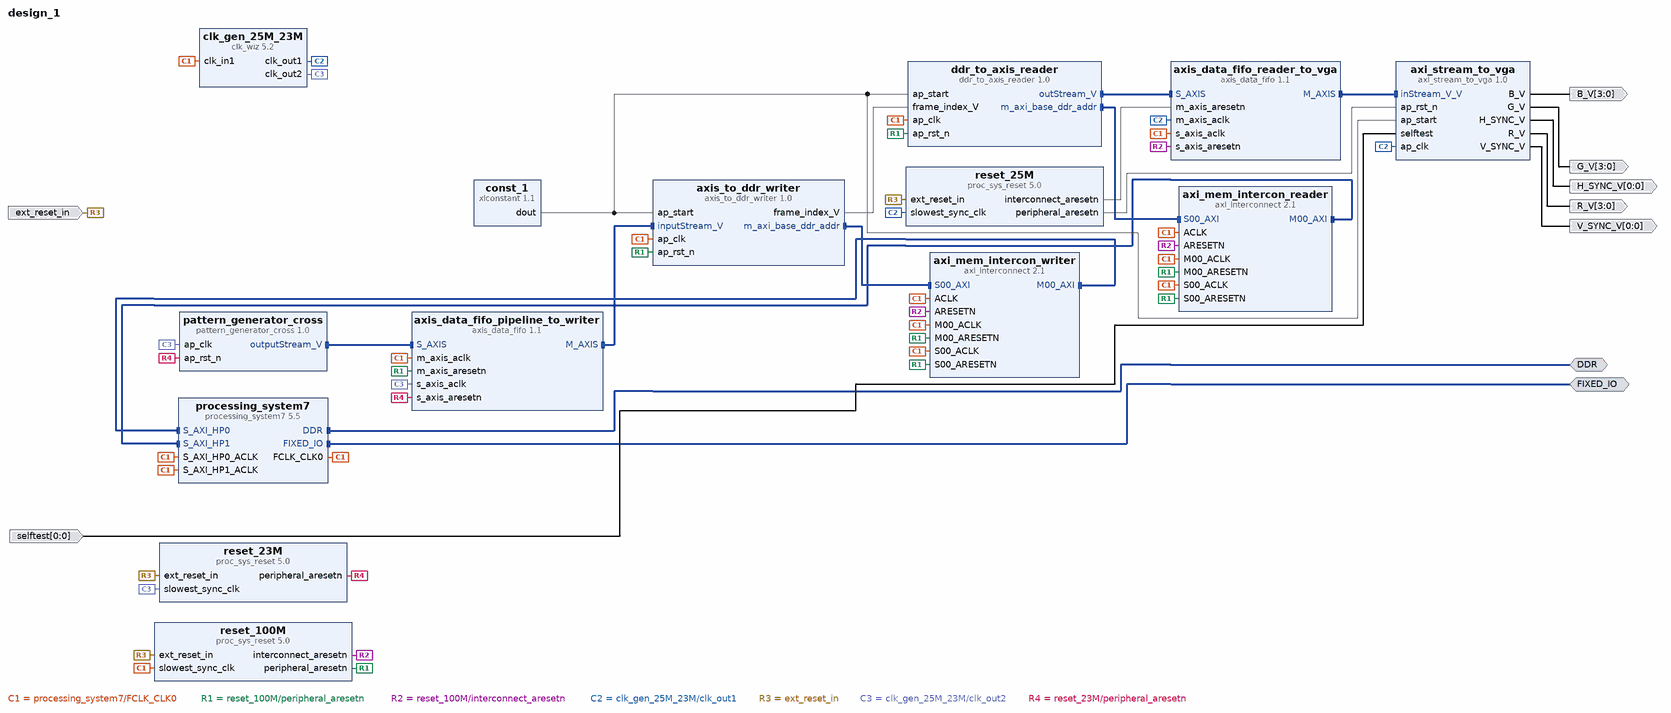
[diagram p0: block diagram of the top level]
# Vivado block design design_1, Vivado 2015.4
create_bd_design design_1

create_bd_intf_port -mode Master -vlnv xilinx.com:interface:ddrx_rtl:1.0 DDR
create_bd_intf_port -mode Master -vlnv xilinx.com:display_processing_system7:fixedio_rtl:1.0 FIXED_IO
create_bd_port -dir I -type rst ext_reset_in
create_bd_port -dir O -from 3 -to 0 -type data R_V
create_bd_port -dir O -from 3 -to 0 -type data G_V
create_bd_port -dir O -from 3 -to 0 -type data B_V
create_bd_port -dir O -from 0 -to 0 -type data V_SYNC_V
create_bd_port -dir O -from 0 -to 0 -type data H_SYNC_V
create_bd_port -dir I -from 0 -to 0 -type data selftest
set_property -dict [list \
  CONFIG.LAYERED_METADATA {xilinx.com:interface:datatypes:1.0 {DATA {datatype {name {attribs {resolve_type immediate dependency {} format string minimum {} maximum {}} value {}} bitwidth {attribs {resolve_type immediate dependency {} format long minimum {} maximum {}} value 1} bitoffset {attribs {resolve_type immediate dependency {} format long minimum {} maximum {}} value 0}}}}} \
] [get_bd_ports selftest]

create_bd_cell -type ip -vlnv xilinx.com:ip:processing_system7:5.5 processing_system7
set_property -dict [list \
  CONFIG.PCW_USE_M_AXI_GP0 0 \
  CONFIG.PCW_USE_S_AXI_HP0 1 \
  CONFIG.PCW_USE_S_AXI_HP1 1 \
  CONFIG.preset ZedBoard \
] [get_bd_cells processing_system7]
create_bd_cell -type ip -vlnv xilinx.com:ip:axis_data_fifo:1.1 axis_data_fifo_reader_to_vga
set_property -dict {CONFIG.IS_ACLK_ASYNC 1} [get_bd_cells axis_data_fifo_reader_to_vga]
create_bd_cell -type ip -vlnv xilinx.com:ip:axi_interconnect:2.1 axi_mem_intercon_writer
set_property -dict {CONFIG.NUM_MI 1} [get_bd_cells axi_mem_intercon_writer]
create_bd_cell -type ip -vlnv xilinx.com:ip:proc_sys_reset:5.0 reset_100M
create_bd_cell -type ip -vlnv xilinx.com:ip:axi_interconnect:2.1 axi_mem_intercon_reader
set_property -dict {CONFIG.NUM_MI 1} [get_bd_cells axi_mem_intercon_reader]
create_bd_cell -type ip -vlnv xilinx.com:ip:clk_wiz:5.2 clk_gen_25M_23M
set_property -dict [list \
  CONFIG.CLKOUT2_USED true \
  CONFIG.NUM_OUT_CLKS 2 \
  CONFIG.CLKOUT1_REQUESTED_OUT_FREQ 25.175 \
  CONFIG.CLKOUT2_REQUESTED_OUT_FREQ 23 \
  CONFIG.USE_LOCKED false \
  CONFIG.USE_RESET false \
  CONFIG.MMCM_DIVCLK_DIVIDE 3 \
  CONFIG.MMCM_CLKFBOUT_MULT_F 35.875 \
  CONFIG.MMCM_CLKOUT0_DIVIDE_F 47.500 \
  CONFIG.MMCM_CLKOUT1_DIVIDE 52 \
  CONFIG.CLKOUT1_JITTER 210.025 \
  CONFIG.CLKOUT1_PHASE_ERROR 175.059 \
  CONFIG.CLKOUT2_JITTER 215.269 \
  CONFIG.CLKOUT2_PHASE_ERROR 175.059 \
] [get_bd_cells clk_gen_25M_23M]
create_bd_cell -type ip -vlnv xilinx.com:ip:proc_sys_reset:5.0 reset_25M
create_bd_cell -type ip -vlnv xilinx.com:ip:proc_sys_reset:5.0 reset_23M
create_bd_cell -type ip -vlnv xilinx.com:ip:axis_data_fifo:1.1 axis_data_fifo_pipeline_to_writer
set_property -dict {CONFIG.IS_ACLK_ASYNC 1} [get_bd_cells axis_data_fifo_pipeline_to_writer]
create_bd_cell -type ip -vlnv xilinx.com:hls:pattern_generator_cross:1.0 pattern_generator_cross
create_bd_cell -type ip -vlnv xilinx.com:hls:axi_stream_to_vga:1.0 axi_stream_to_vga
create_bd_cell -type ip -vlnv xilinx.com:hls:axis_to_ddr_writer:1.0 axis_to_ddr_writer
set_property -dict {CONFIG.C_M_AXI_BASE_DDR_ADDR_TARGET_ADDR 0x10000000} [get_bd_cells axis_to_ddr_writer]
create_bd_cell -type ip -vlnv xilinx.com:hls:ddr_to_axis_reader:1.0 ddr_to_axis_reader
set_property -dict {CONFIG.C_M_AXI_BASE_DDR_ADDR_TARGET_ADDR 0x10000000} [get_bd_cells ddr_to_axis_reader]
create_bd_cell -type ip -vlnv xilinx.com:ip:xlconstant:1.1 const_1

# ---- connections ----

connect_bd_intf_net -intf_net axi_mem_intercon_M00_AXI [get_bd_intf_pins axi_mem_intercon_writer/M00_AXI] [get_bd_intf_pins processing_system7/S_AXI_HP0]
connect_bd_intf_net -intf_net axi_mem_intercon_1_M00_AXI [get_bd_intf_pins axi_mem_intercon_reader/M00_AXI] [get_bd_intf_pins processing_system7/S_AXI_HP1]
connect_bd_intf_net -intf_net axis_data_fifo_0_M_AXIS [get_bd_intf_pins axis_data_fifo_reader_to_vga/M_AXIS] [get_bd_intf_pins axi_stream_to_vga/inStream_V_V]
connect_bd_intf_net [get_bd_intf_pins ddr_to_axis_reader/outStream_V] [get_bd_intf_pins axis_data_fifo_reader_to_vga/S_AXIS]
connect_bd_intf_net [get_bd_intf_pins axis_to_ddr_writer/m_axi_base_ddr_addr] [get_bd_intf_pins axi_mem_intercon_writer/S00_AXI]
connect_bd_intf_net [get_bd_intf_pins ddr_to_axis_reader/m_axi_base_ddr_addr] [get_bd_intf_pins axi_mem_intercon_reader/S00_AXI]
connect_bd_intf_net [get_bd_intf_pins axis_data_fifo_pipeline_to_writer/M_AXIS] [get_bd_intf_pins axis_to_ddr_writer/inputStream_V]
connect_bd_intf_net -intf_net pattern_generator_cross_0_outputStream_V [get_bd_intf_pins pattern_generator_cross/outputStream_V] [get_bd_intf_pins axis_data_fifo_pipeline_to_writer/S_AXIS]
connect_bd_intf_net -intf_net processing_system7_0_DDR [get_bd_intf_ports DDR] [get_bd_intf_pins processing_system7/DDR]
connect_bd_intf_net -intf_net processing_system7_0_FIXED_IO [get_bd_intf_ports FIXED_IO] [get_bd_intf_pins processing_system7/FIXED_IO]
connect_bd_net -net ap_start_1 [get_bd_pins const_1/dout] \
  [get_bd_pins axi_stream_to_vga/ap_start] [get_bd_pins axis_to_ddr_writer/ap_start] \
  [get_bd_pins ddr_to_axis_reader/ap_start]
connect_bd_net -net processing_system7_0_FCLK_CLK0 [get_bd_pins processing_system7/FCLK_CLK0] \
  [get_bd_pins processing_system7/S_AXI_HP0_ACLK] [get_bd_pins processing_system7/S_AXI_HP1_ACLK] \
  [get_bd_pins clk_gen_25M_23M/clk_in1] [get_bd_pins axis_data_fifo_reader_to_vga/s_axis_aclk] \
  [get_bd_pins reset_100M/slowest_sync_clk] [get_bd_pins axis_data_fifo_pipeline_to_writer/m_axis_aclk] \
  [get_bd_pins axi_mem_intercon_writer/S00_ACLK] [get_bd_pins axi_mem_intercon_writer/ACLK] \
  [get_bd_pins axi_mem_intercon_writer/M00_ACLK] [get_bd_pins axi_mem_intercon_reader/S00_ACLK] \
  [get_bd_pins axi_mem_intercon_reader/ACLK] [get_bd_pins axi_mem_intercon_reader/M00_ACLK] \
  [get_bd_pins axis_to_ddr_writer/ap_clk] [get_bd_pins ddr_to_axis_reader/ap_clk]
connect_bd_net -net rst_processing_system7_0_100M_peripheral_aresetn [get_bd_pins reset_100M/peripheral_aresetn] \
  [get_bd_pins axis_data_fifo_pipeline_to_writer/m_axis_aresetn] [get_bd_pins axi_mem_intercon_writer/S00_ARESETN] \
  [get_bd_pins axi_mem_intercon_writer/M00_ARESETN] [get_bd_pins axi_mem_intercon_reader/S00_ARESETN] \
  [get_bd_pins axi_mem_intercon_reader/M00_ARESETN] [get_bd_pins axis_to_ddr_writer/ap_rst_n] \
  [get_bd_pins ddr_to_axis_reader/ap_rst_n]
connect_bd_net -net rst_processing_system7_0_100M_interconnect_aresetn [get_bd_pins reset_100M/interconnect_aresetn] \
  [get_bd_pins axis_data_fifo_reader_to_vga/s_axis_aresetn] [get_bd_pins axi_mem_intercon_writer/ARESETN] \
  [get_bd_pins axi_mem_intercon_reader/ARESETN]
connect_bd_net -net clk_wiz_0_clk_out1 [get_bd_pins clk_gen_25M_23M/clk_out1] \
  [get_bd_pins axis_data_fifo_reader_to_vga/m_axis_aclk] [get_bd_pins reset_25M/slowest_sync_clk] \
  [get_bd_pins axi_stream_to_vga/ap_clk]
connect_bd_net [get_bd_ports ext_reset_in] \
  [get_bd_pins reset_100M/ext_reset_in] [get_bd_pins reset_25M/ext_reset_in] [get_bd_pins reset_23M/ext_reset_in]
connect_bd_net [get_bd_pins reset_25M/interconnect_aresetn] [get_bd_pins axis_data_fifo_reader_to_vga/m_axis_aresetn]
connect_bd_net -net axi_stream_to_vga_0_R_V [get_bd_pins axi_stream_to_vga/R_V] [get_bd_ports R_V]
connect_bd_net -net axi_stream_to_vga_0_G_V [get_bd_pins axi_stream_to_vga/G_V] [get_bd_ports G_V]
connect_bd_net -net axi_stream_to_vga_0_B_V [get_bd_pins axi_stream_to_vga/B_V] [get_bd_ports B_V]
connect_bd_net -net axi_stream_to_vga_0_V_SYNC_V [get_bd_pins axi_stream_to_vga/V_SYNC_V] [get_bd_ports V_SYNC_V]
connect_bd_net -net axi_stream_to_vga_0_H_SYNC_V [get_bd_pins axi_stream_to_vga/H_SYNC_V] [get_bd_ports H_SYNC_V]
connect_bd_net [get_bd_pins reset_25M/peripheral_aresetn] [get_bd_pins axi_stream_to_vga/ap_rst_n]
connect_bd_net [get_bd_ports selftest] [get_bd_pins axi_stream_to_vga/selftest]
connect_bd_net [get_bd_pins clk_gen_25M_23M/clk_out2] \
  [get_bd_pins reset_23M/slowest_sync_clk] [get_bd_pins axis_data_fifo_pipeline_to_writer/s_axis_aclk] \
  [get_bd_pins pattern_generator_cross/ap_clk]
connect_bd_net -net proc_sys_reset_0_peripheral_aresetn [get_bd_pins reset_23M/peripheral_aresetn] \
  [get_bd_pins axis_data_fifo_pipeline_to_writer/s_axis_aresetn] [get_bd_pins pattern_generator_cross/ap_rst_n]
connect_bd_net [get_bd_pins axis_to_ddr_writer/frame_index_V] [get_bd_pins ddr_to_axis_reader/frame_index_V]
# net frame_count has one end: 
# net frame_count_equals has one end: 
# net frame_count_1 has one end: 

# ---- address map ----
assign_bd_address -offset 0x00000000 -range 512M -target_address_space [get_bd_addr_spaces axis_to_ddr_writer/Data_m_axi_base_ddr_addr] [get_bd_addr_segs processing_system7/S_AXI_HP0/HP0_DDR_LOWOCM]
assign_bd_address -offset 0x00000000 -range 512M -target_address_space [get_bd_addr_spaces ddr_to_axis_reader/Data_m_axi_base_ddr_addr] [get_bd_addr_segs processing_system7/S_AXI_HP1/HP1_DDR_LOWOCM]

validate_bd_design
save_bd_design
